# EAGLE design Termo3 (EAGLE 6.2)
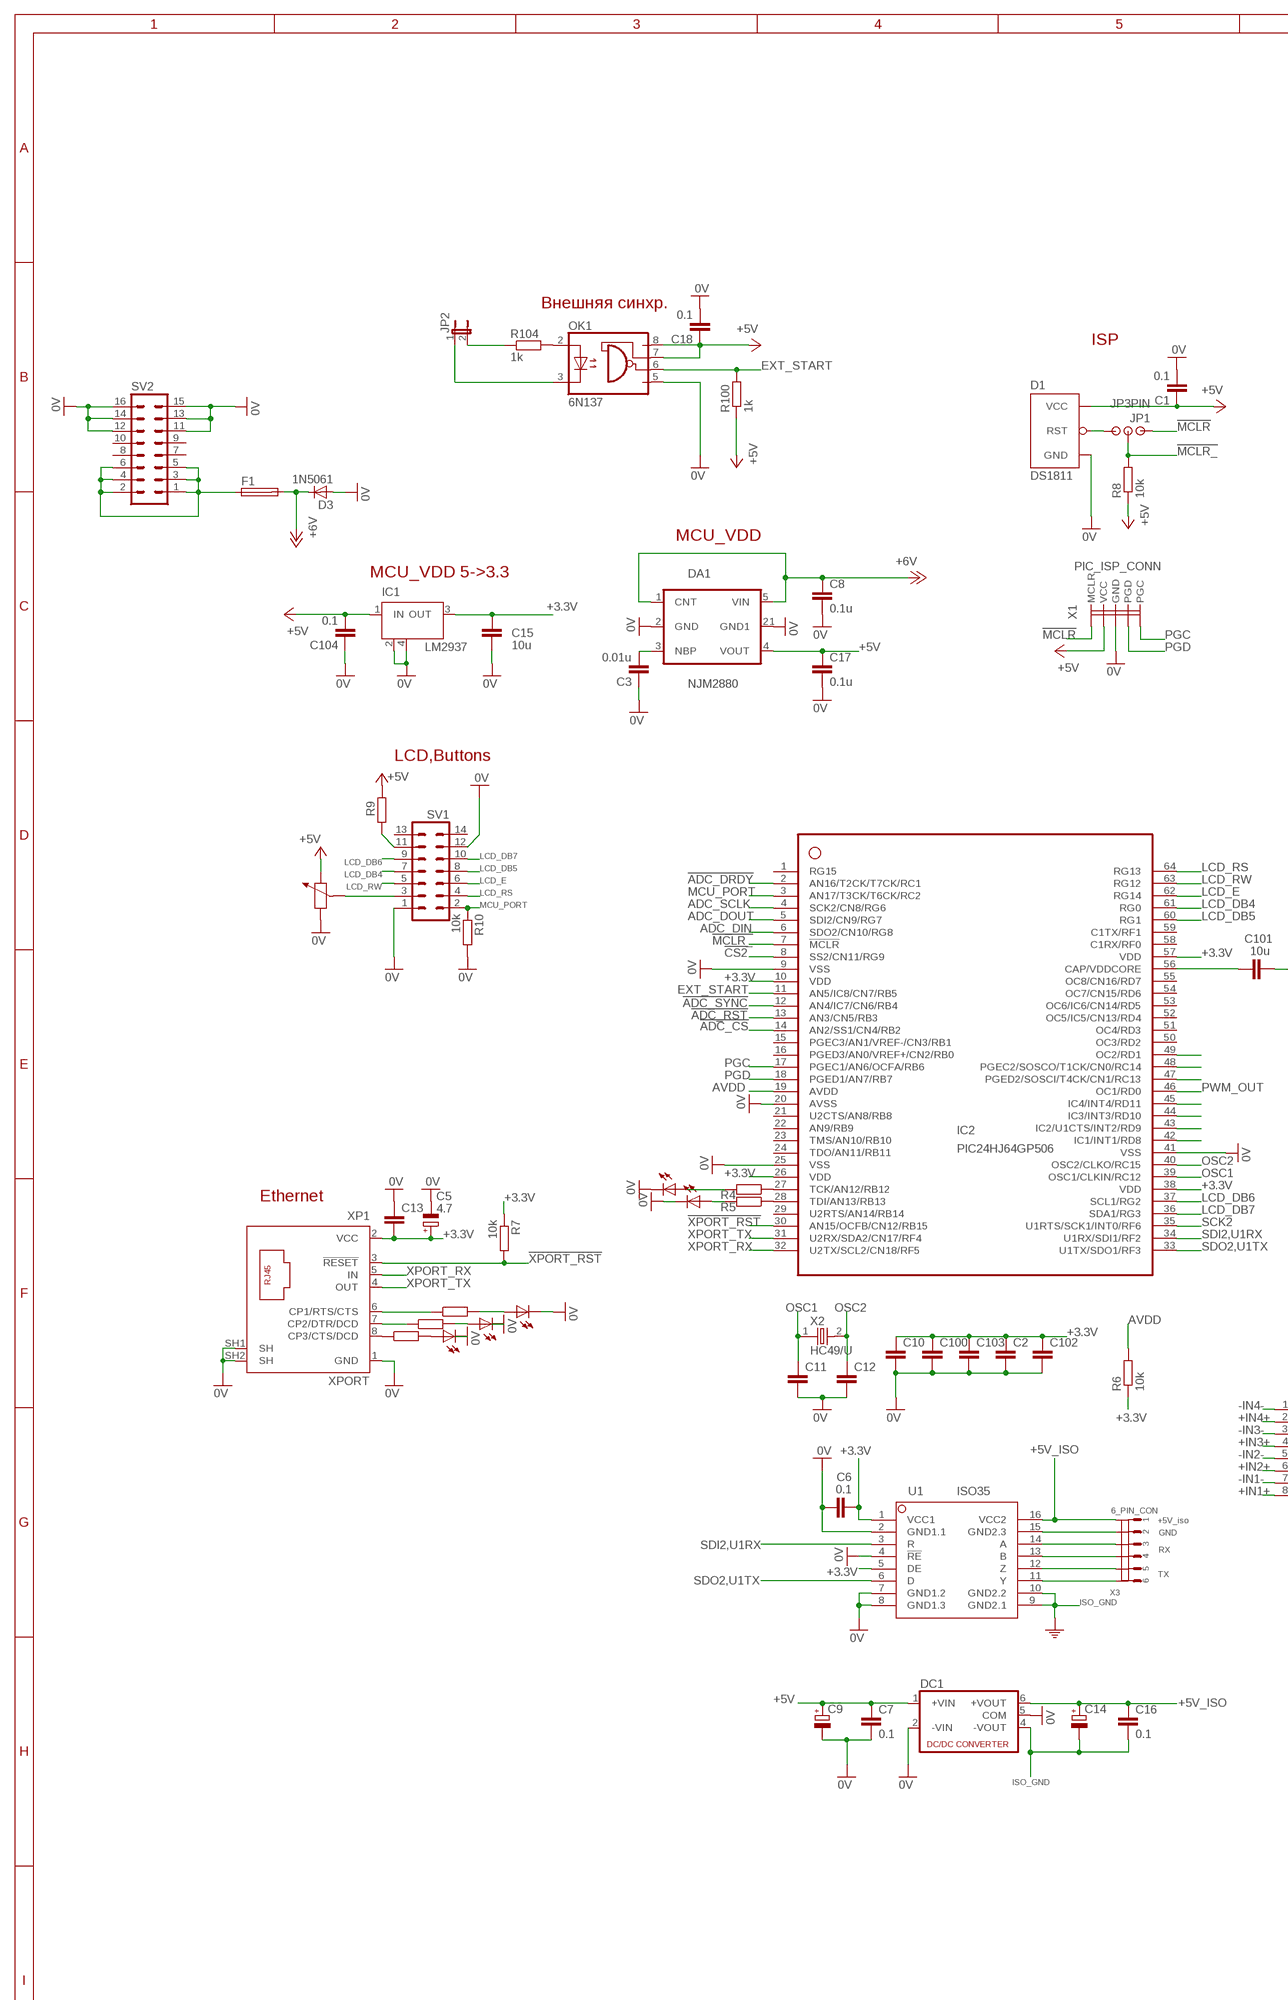
[diagram p0: schematic, sheet 1, part 1 of 2]
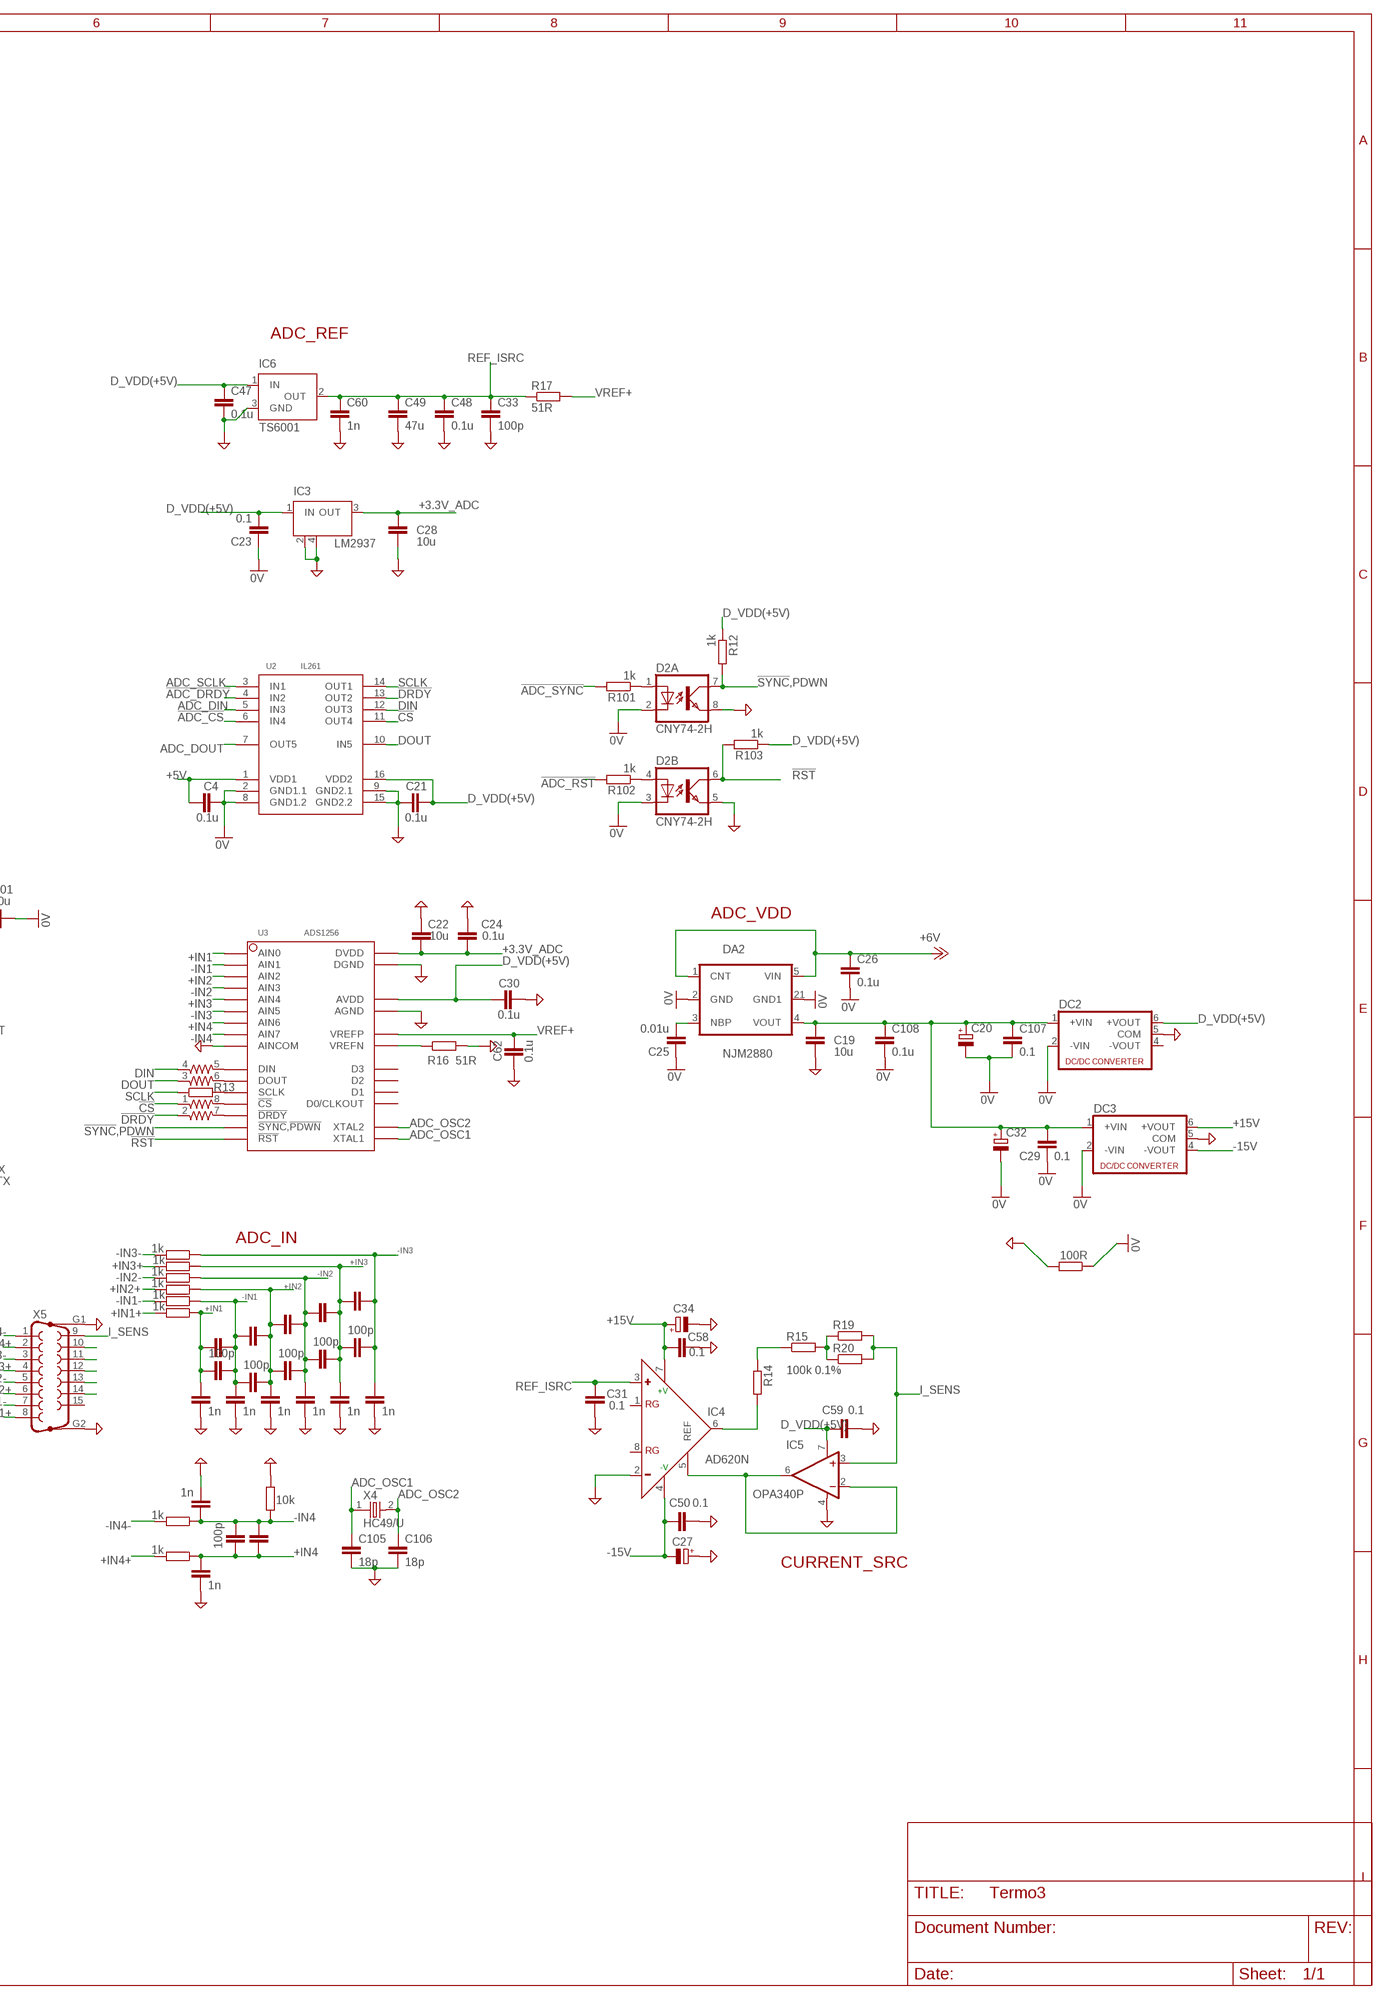
[diagram p1: schematic, sheet 1, part 2 of 2]

## Parts
C1  0.1  C0805  [C0805D]
C2  C0805  [C0805D]
C3  0.01u  C0805  [C0805D]
C4  0.1u  C0805  [C0805D]
C5  4.7  C100MFX25V  [C100MILX6X12]
C6  0.1  C0805  [C0805D]
C7  0.1  C0805  [C0805D]
C8  0.1u  C0805  [C0805D]
C9  C100MFX25V  [C100MILX6X12]
C10  C0805  [C0805D]
C11  C0805  [C0805D]
C12  C0805  [C0805D]
C13  C0805  [C0805D]
C14  C100MFX25V  [C100MILX6X12]
C15  10u  C0805  [C0805D]
C16  0.1  C0805  [C0805D]
C17  0.1u  C0805  [C0805D]
C18  0.1  C0805  [C0805D]
C19  10u  C0805  [C0805D]
C20  C100MFX25V  [C100MILX6X12]
C21  0.1u  C0805  [C0805D]
C22  10u  C0805  [C0805D]
C23  0.1  C0805  [C0805D]
C24  0.1u  C0805  [C0805D]
C25  0.01u  C0805  [C0805D]
C26  0.1u  C0805  [C0805D]
C27  C100MFX25V  [C100MILX6X12]
C28  10u  C0805  [C0805D]
C29  0.1  C0805  [C0805D]
C30  0.1u  C0805  [C0805D]
C31  0.1  C0805  [C0805D]
C32  C100MFX25V  [C100MILX6X12]
C33  100p  C0805  [C0805D]
C34  C100MFX25V  [C100MILX6X12]
C35  100p  C0805  [C0805D]
C36  100p  C0805  [C0805D]
C37  100p  C0805  [C0805D]
C38  100p  C0805  [C0805D]
C39  100p  C0805  [C0805D]
C40  100p  C0805  [C0805D]
C41  1n  C0805  [C0805D]
C42  1n  C0805  [C0805D]
C43  1n  C0805  [C0805D]
C44  1n  C0805  [C0805D]
C45  1n  C0805  [C0805D]
C46  1n  C0805  [C0805D]
C47  0.1u  C0805  [C0805D]
C48  0.1u  C0805  [C0805D]
C49  47u  C0805  [C0805D]
C50  0.1  C0805  [C0805D]
C51  1n  C0805  [C0805D]
C52  1n  C0805  [C0805D]
C53  1n  C0805  [C0805D]
C54  1n  C0805  [C0805D]
C55  1n  C0805  [C0805D]
C56  1n  C0805  [C0805D]
C57  1n  C0805  [C0805D]
C58  0.1  C0805  [C0805D]
C59  0.1  C0805  [C0805D]
C60  1n  C0805  [C0805D]
C61  1n  C0805  [C0805D]
C62  0.1u  C0805  [C0805D]
C100  C0805  [C0805D]
C101  10u  C0805  [C0805D]
C102  C0805  [C0805D]
C103  C0805  [C0805D]
C104  0.1  C0805  [C0805D]
C105  18p  C0805  [C0805D]
C106  18p  C0805  [C0805D]
C107  0.1  C0805  [C0805D]
C108  0.1u  C0805  [C0805D]
D1  DS1811  [TO92-60]
D2  CNY74-2H  [DIL08]
D3  1N5061  [DO41-10]
DA1  NJM2880  [SOT89-5]
DA2  NJM2880  [SOT89-5]
DC1  NMA  [NMA]
DC2  NMA  [NMA]
DC3  NMA  [NMA]
F1  TE5  [TE5]
HL1  LED3MM  [LED3MM]
HL2  LED3MM  [LED3MM]
HL3  LED3MM  [LED3MM]
HL4  LED3MM  [LED3MM]
HL5  LED3MM  [LED3MM]
IC1  LM2937  [SOT223]
IC2  PIC24HJ64GP506  [TQFP64-10X10]
IC3  LM2937  [SOT223]
IC4  AD620N  [DIL08]
IC5  OPA340P  [DIL08]
IC6  TS6001  [SOT23]
JP1  JP3PIN  [PLC-3PIN]
JP2  JP1E  [JP1]
OK1  6N137  [DIL08]
POT1  RTRIM3329H  [RTRIM3329H]
R1  1k  R0805  [R0805D]
R2  1k  R0805  [R0805D]
R3  1k  R0805  [R0805D]
R4  51R  R0805  [R0805D]
R5  51R  R0805  [R0805D]
R6  10k  R0805  [R0805D]
R7  10k  R0805  [R0805D]
R8  10k  R0805  [R0805D]
R9  MLT025"  [0207/10]
R10  10k  R0805  [R0805D]
R11  100R  R0805  [R0805D]
R12  1k  R0805  [R0805D]
R13  51R  R0805  [R0805D]
R14  MLT025"  [0207/10]
R15  100k 0.1%  MLT025"  [0207/10]
R16  51R  R0805  [R0805D]
R17  51R  R0805  [R0805D]
R18  10k  R0805  [R0805D]
R19  MLT025"  [0207/10]
R20  MLT025"  [0207/10]
R21  1k  R0805  [R0805D]
R22  1k  R0805  [R0805D]
R23  1k  R0805  [R0805D]
R24  1k  R0805  [R0805D]
R25  1k  R0805  [R0805D]
R26  1k  R0805  [R0805D]
R27  1k  R0805  [R0805D]
R28  1k  R0805  [R0805D]
R100  1k  R0805  [R0805D]
R101  1k  R0805  [R0805D]
R102  1k  R0805  [R0805D]
R103  1k  R0805  [R0805D]
R104  1k  R0805  [R0805D]
RN1  742-8_SNS  [742-8NS]
SV1  ML14  [ML14]
SV2  MA08-2W  [MA08-2W]
U1  ISO35  [ISO35_SOIC16]
U2  IL261  [SOIC-16]
U3  ADS1256  [PCM2705-TSSOP28]
X1  PIC_ISP_CONN  [PLC-5PIN]
X2  HC49/U  [HC49U-V]
X3  6_PIN_CON  [6_IN_PINS]
X4  HC49/U  [HC49U-V]
X5  F15HP  [F15HP]
XP1  XPORT  [XPORT]

## Nets
0V: C1.2 C2.2 C3.1 C4.2 C5.MINUS(-) C6.1 C7.2 C8.2 C9.MINUS(-) C10.2 C11.2 C12.2 C13.1 C15.1 C17.2 C18.2 C20.MINUS(-) C23.1 C25.1 C26.2 C29.1 C32.MINUS(-) C100.2 C101.2 C102.2 C103.2 C104.1 C107.2 C108.2 D1.3(GND) D2.2(A:C) D2.3(B:C) D3.A DA1.2(GND) DA1.21(GND1) DA2.2(GND) DA2.21(GND1) DC1.2(-VIN) DC1.5(COM) DC2.2(-VIN) DC3.2(-VIN) HL1.K(C) HL2.K(C) HL3.K(C) HL4.K(C) HL5.K(C) IC1.2(GND) IC1.4(GND) IC2.9(VSS) IC2.20(AVSS) IC2.25(VSS) IC2.41(VSS) OK1.5(GND) POT1.1 R10.P$2 R11.P$1 SV1.1 SV1.12 SV2.11 SV2.12 SV2.13 SV2.14 SV2.15 SV2.16 U1.2(GND1.1) U1.4(!RE) U1.7(GND1.2) U1.8(GND1.3) U2.2(GND1.1) U2.8(GND1.2) X1.P$3(GND) XP1.1(GND) XP1.SH1(SH) XP1.SH2(SH)
!ADC_CS: IC2.14(AN2/SS1/CN4/RB2) U2.6(IN4)
!ADC_DRDY: IC2.2(AN16/T2CK/T7CK/RC1) U2.4(IN2)
!ADC_RST: IC2.13(AN3/CN5/RB3) R102.P$2
!ADC_SYNC: IC2.12(AN4/IC7/CN6/RB4) R101.P$2
!CS: RN1.1 U2.11(OUT4)
!CS2: IC2.8(SS2/CN11/RG9)
!DRDY: RN1.2 U2.13(OUT2)
!MCLR: JP1.P$1 X1.P$1(MCLR)
!MCLR_: IC2.7(!MCLR) JP1.P$2 R8.P$2
!RST: D2.6(B:COL) R103.P$2 U3.15(!RST)
!SYNC,PDWN: D2.7(A:COL) R12.P$2 U3.14(!SYNC,!PDWN)
!XPORT_RST: IC2.30(AN15/OCFB/CN12/RB15) R7.P$2 XP1.3(!RESET)
+3.3V: C2.1 C5.PLUS(+) C6.2 C10.1 C13.2 C15.2 C100.1 C102.1 C103.1 IC1.3(OUT) IC2.10(VDD) IC2.26(VDD) IC2.38(VDD) IC2.57(VDD) R6.P$1 R7.P$1 U1.1(VCC1) U1.5(DE) XP1.2(VCC)
+3.3V_ADC: C22.2 C24.1 C28.2 IC3.3(OUT) U3.16(DVDD)
+5V: C1.1 C4.1 C7.1 C9.PLUS(+) C17.1 C18.1 C104.2 D1.2(VCC) DA1.4(VOUT) DC1.1(+VIN) IC1.1(IN) OK1.7(VE) OK1.8(VCC) POT1.2 R8.P$1 R9.2 R100.P$1 U2.1(VDD1) X1.P$2(VCC)
+5V_ISO: C14.PLUS(+) C16.1 DC1.6(+VOUT) U1.16(VCC2) X3.P$1
+6V: C8.1 C26.1 D3.C DA1.1(CNT) DA1.5(VIN) DA2.1(CNT) DA2.5(VIN) F1.2
+15V: C34.PLUS(+) C58.2 DC3.6(+VOUT) IC4.7(+V)
+IN1: C40.1 C46.1 C57.1 R28.P$1 U3.6(AIN0)
+IN1+: R28.P$2 X5.8
+IN2: C38.1 C39.2 C44.1 C45.2 C55.1 R26.P$1 U3.8(AIN2)
+IN2+: R26.P$2 X5.6
+IN3: C36.1 C37.2 C42.1 C43.2 C53.1 R24.P$1 U3.10(AIN4)
+IN3+: R24.P$2 X5.4
+IN4: C35.1 C41.1 C51.1 R22.P$1 U3.12(AIN6)
+IN4+: R22.P$2 X5.2
-15V: C27.MINUS(-) C50.2 DC3.4(-VOUT) IC4.4(-V)
-IN1: C39.1 C40.2 C45.1 C46.2 C56.1 R27.P$1 U3.7(AIN1)
-IN1-: R27.P$2 X5.7
-IN2: C37.1 C38.2 C43.1 C44.2 C54.1 R25.P$1 U3.9(AIN3)
-IN2-: R25.P$2 X5.5
-IN3: C36.2 C42.2 C52.1 R23.P$1 U3.11(AIN5)
-IN3-: R23.P$2 X5.3
-IN4: C35.2 C41.2 C61.1 R18.P$2 R21.P$1 U3.13(AIN7)
-IN4-: R21.P$2 X5.1
ADC_AVDD: C19.2 C20.PLUS(+) C29.2 C32.PLUS(+) C107.1 C108.1 DA2.4(VOUT) DC2.1(+VIN) DC3.1(+VIN)
ADC_DIN: IC2.6(SDO2/CN10/RG8) U2.5(IN3)
ADC_DOUT: IC2.5(SDI2/CN9/RG7) U2.7(OUT5)
ADC_OSC1: C105.1 U3.19(XTAL1) X4.1
ADC_OSC2: C106.1 U3.18(XTAL2) X4.2
ADC_SCLK: IC2.4(SCK2/CN8/RG6) U2.3(IN1)
AVDD: IC2.19(AVDD) R6.P$2
D_VDD(+5V): C21.2 C30.1 C47.1 C59.1 DC2.6(+VOUT) IC3.1(IN) IC5.7(V+) IC6.1(IN) R12.P$1 R103.P$1 U2.16(VDD2) U3.1(AVDD)
DGND: C19.1 C21.1 C22.1 C24.2 C27.PLUS(+) C28.1 C30.2 C31.2 C33.2 C34.MINUS(-) C47.2 C48.2 C49.2 C50.1 C51.2 C52.2 C53.2 C54.2 C55.2 C56.2 C57.2 C58.1 C59.2 C60.2 C61.2 C62.1 C105.2 C106.2 D2.5(B:EMIT) D2.8(A:EMIT) DC2.5(COM) DC3.5(COM) IC3.2(GND) IC3.4(GND) IC4.2(-) IC5.4(V-) IC6.3(GND) R11.P$2 R16.P$2 R18.P$1 U2.9(GND2.1) U2.15(GND2.2) U3.2(AGND) U3.5(AINCOM) U3.17(DGND) X5.G1 X5.G2
DIN: RN1.4 U2.12(OUT3)
DOUT: RN1.3 U2.10(IN5)
EXT_START: IC2.11(AN5/IC8/CN7/RB5) OK1.6(VO) R100.P$2
I_SENS: IC5.3(+IN) R19.2 R20.2 X5.9
ISO_GND: C14.MINUS(-) C16.2 DC1.4(-VOUT) U1.9(GND2.1) U1.10(GND2.2) U1.15(GND2.3) X3.P$2 ; supply symbol labelled PE
LCD_DB4: IC2.61(RG0) SV1.7
LCD_DB5: IC2.60(RG1) SV1.8
LCD_DB6: IC2.37(SCL1/RG2) SV1.9
LCD_DB7: IC2.36(SDA1/RG3) SV1.10
LCD_E: IC2.62(RG14) SV1.6
LCD_RS: IC2.64(RG13) SV1.4
LCD_RW: IC2.63(RG12) SV1.5
MCU_PORT: IC2.3(AN17/T3CK/T6CK/RC2) R10.P$1 SV1.2
N$1: C101.1 IC2.56(CAP/VDDCORE)
N$2: D1.1(RST) JP1.P$3
N$3: RN1.8 U3.20(!CS)
N$4: RN1.7 U3.21(!DRDY)
N$5: RN1.6 U3.22(DOUT)
N$6: RN1.5 U3.23(DIN)
N$7: R13.P$2 U3.24(SCLK)
N$9: IC2.45(IC4/INT4/RD11)
N$10: D2.1(A:A) R101.P$1
N$11: IC2.44(IC3/INT3/RD10)
N$12: IC4.5(REF) IC5.2(-IN) IC5.6(OUT)
N$13: IC2.43(IC2/U1CTS/INT2/RD9)
N$14: C25.2 DA2.3(NBP)
N$15: D2.4(B:A) R102.P$1
N$16: C3.2 DA1.3(NBP)
N$17: IC4.6(OUT) R14.2
N$18: POT1.3 SV1.3
N$19: R9.1 SV1.11
N$20: IC2.28(TDI/AN13/RB13) R5.P$1
N$21: HL2.A R5.P$2
N$22: IC2.42(IC1/INT1/RD8)
N$23: U1.3(R)
N$24: JP2.1 OK1.3(C)
N$25: IC2.47(PGED2/SOSCI/T4CK/CN1/RC13)
N$26: HL3.A R1.P$2
N$27: IC2.48(PGEC2/SOSCO/T1CK/CN0/RC14)
N$28: R1.P$1 XP1.6(CP1/RTS/CTS)
N$29: R2.P$1 XP1.7(CP2/DTR/DCD)
N$30: R3.P$1 XP1.8(CP3/CTS/DCD)
N$31: HL4.A R2.P$2
N$32: HL5.A R3.P$2
N$33: IC2.49(OC2/RD1)
N$37: X5.10
N$38: OK1.2(A) R104.P$2
N$39: JP2.2 R104.P$1
N$40: X5.11
N$41: X5.12
N$42: F1.1 SV2.1 SV2.2 SV2.3 SV2.4 SV2.5 SV2.6
N$43: IC2.27(TCK/AN12/RB12) R4.P$1
N$44: R14.1 R15.1
N$45: R16.P$1 U3.3(VREFN)
N$46: R15.2 R19.1 R20.1
N$47: U1.14(A) X3.P$3
N$48: HL1.A R4.P$2
N$49: X5.13
N$50: X5.14
N$51: U1.13(B) X3.P$4
N$52: U1.12(Z) X3.P$5
N$53: U1.11(Y) X3.P$6
OSC1: C11.1 IC2.39(OSC1/CLKIN/RC12) X2.1
OSC2: C12.1 IC2.40(OSC2/CLKO/RC15) X2.2
PGC: IC2.17(PGEC1/AN6/OCFA/RB6) X1.P$5(PGC)
PGD: IC2.18(PGED1/AN7/RB7) X1.P$4(PGD)
PWM_OUT: IC2.46(OC1/RD0)
REF_ISRC: C31.1 C33.1 C48.1 C49.1 C60.1 IC4.3(+) IC6.2(OUT) R17.P$1
SCK2: IC2.35(U1RTS/SCK1/INT0/RF6)
SCLK: R13.P$1 U2.14(OUT1)
SDI2,U1RX: IC2.34(U1RX/SDI1/RF2)
SDO2,U1TX: IC2.33(U1TX/SDO1/RF3) U1.6(D)
VREF+: C62.2 R17.P$2 U3.4(VREFP)
XPORT_RX: IC2.32(U2TX/SCL2/CN18/RF5) XP1.5(IN)
XPORT_TX: IC2.31(U2RX/SDA2/CN17/RF4) XP1.4(OUT)
Unconnected: C23.2 DC2.4(-VOUT) IC2.1(RG15) IC2.15(PGEC3/AN1/VREF-/CN3/RB1) IC2.16(PGED3/AN0/VREF+/CN2/RB0) IC2.21(U2CTS/AN8/RB8) IC2.22(AN9/RB9) IC2.23(TMS/AN10/RB10) IC2.24(TDO/AN11/RB11) IC2.29(U2RTS/AN14/RB14) IC2.50(OC3/RD2) IC2.51(OC4/RD3) IC2.52(OC5/IC5/CN13/RD4) IC2.53(OC6/IC6/CN14/RD5) IC2.54(OC7/CN15/RD6) IC2.55(OC8/CN16/RD7) IC2.58(C1RX/RF0) IC2.59(C1TX/RF1) IC4.1(RG) IC4.8(RG) SV1.13 SV1.14 SV2.7 SV2.8 SV2.9 SV2.10 U3.25(D0/CLKOUT) U3.26(D1) U3.27(D2) U3.28(D3) X5.15

## Notes on the sheet
- Внешняя синхр.
- ISP
- ADC_REF
- MCU_VDD
- MCU_VDD 5->3.3
- LCD,Buttons
- ADC_VDD
- Ethernet
- ADC_IN
- +5V_iso
- GND
- RX
- TX
- CURRENT_SRC

## Library data of the parts
C1-C4 C6-C8 C10-C13 C15-C19 C21-C26 C28-C31 C33 C35-C62 C100-C108 = den:C0805
C5 C9 C14 C20 C27 C32 C34 = den:C100MFX25V
D1 = den:DS1811
D2 = den:CNY74-2H
D3 = den:1N5061
DA1 DA2 = den:NJM2880
DC1-DC3 = dc-dc-converter:NMA: DC-DC CONVERTER; MF: C & D TECHNOLOGIES, INC; MPN: NMA0515SC; OC_FARNELL: 1021434; OC_NEWARK: 61K3064
F1 = fuse:TE5: FUSE Wickmann; OC_FARNELL: unknown; OC_NEWARK: unknown
HL1-HL5 = den:LED3MM
IC1 IC3 = Dmitry:LM2937: 3-Terminal Positive Regulators
IC2 = Dmitry:PIC24HJ64GP506: PIC24HJ64GP506 edit this description Auto generated by make-symbol-device-package-bsdl.ulp Rev. 25 Source: PIC24HJ64GP506.bsd; MPN: PIC24HJ64GP506A-I/PT; OC_FARNELL: 1146551; OC_NEWARK: 45P4882
IC4 = analog-devices:AD620: Low Cost, Low Power, Instrumentation Amplifier Source: http://www.analog.com/UploadedFiles/Data_Sheets/37793330023930AD620_e.pdf; MF: ALTERA CORPORATION; MPN: AD620AN; OC_FARNELL: 1523782; OC_NEWARK: 05F7108
IC5 = burr-brown:OPA340: Rail-to-Rail Operational Amplifiers Single-Supply, MicroAmplifier(TM) Series; MPN: OPA340PA; OC_FARNELL: 1097413; OC_NEWARK: 97K6826
IC6 = Dmitry:TS6001: 2.5V Voltage Reference 0.8ppm/°C, SOT23, 3-Terminal; MF: TS; OC_FARNELL: unknown; OC_NEWARK: 02J4586
JP1 = den:JP3PIN
JP2 = jumper:JP1E: JUMPER
OK1 = optocoupler:6N137: MOTOROLA OPTO COUPLER; MPN: 6N137; OC_FARNELL: 1328376; OC_NEWARK: 52M1895
POT1 = Dmitry:RTRIM3329H
R1-R8 R10-R13 R16-R18 R21-R28 R100-R104 = den:R0805
R9 R14 R15 R19 R20 = den:MLT025
RN1 = resistor-array:742-8_S: CTS 742 Series 8 Terminations, 4 Resistors
SV1 = con-harting-ml:ML14: HARTING; OC_FARNELL: unknown; OC_NEWARK: unknown
SV2 = con-lstb:MA08-2W: PIN HEADER; OC_FARNELL: unknown; OC_NEWARK: unknown
U1 = Dmitry:ISO35: RS485
U2 = Dmitry:IL261
U3 = Dmitry:ADS1256: TI ADS1256 - 24 bit delta sigma ADC TSSOP28 PAC
X1 = den:PIC_ISP_CONN
X2 X4 = den:HC49/U
X3 = Dmitry:6_PIN_CON
X5 = con-subd:F15HP: SUB-D; OC_FARNELL: unknown; OC_NEWARK: unknown
XP1 = lantronix:XPORT: Serial to 10/100 Ethernet transceiver Source: http://www.lantronix.com/pdf/XPort_DS.pdf; OC_FARNELL: unknown; OC_NEWARK: unknown

## Board
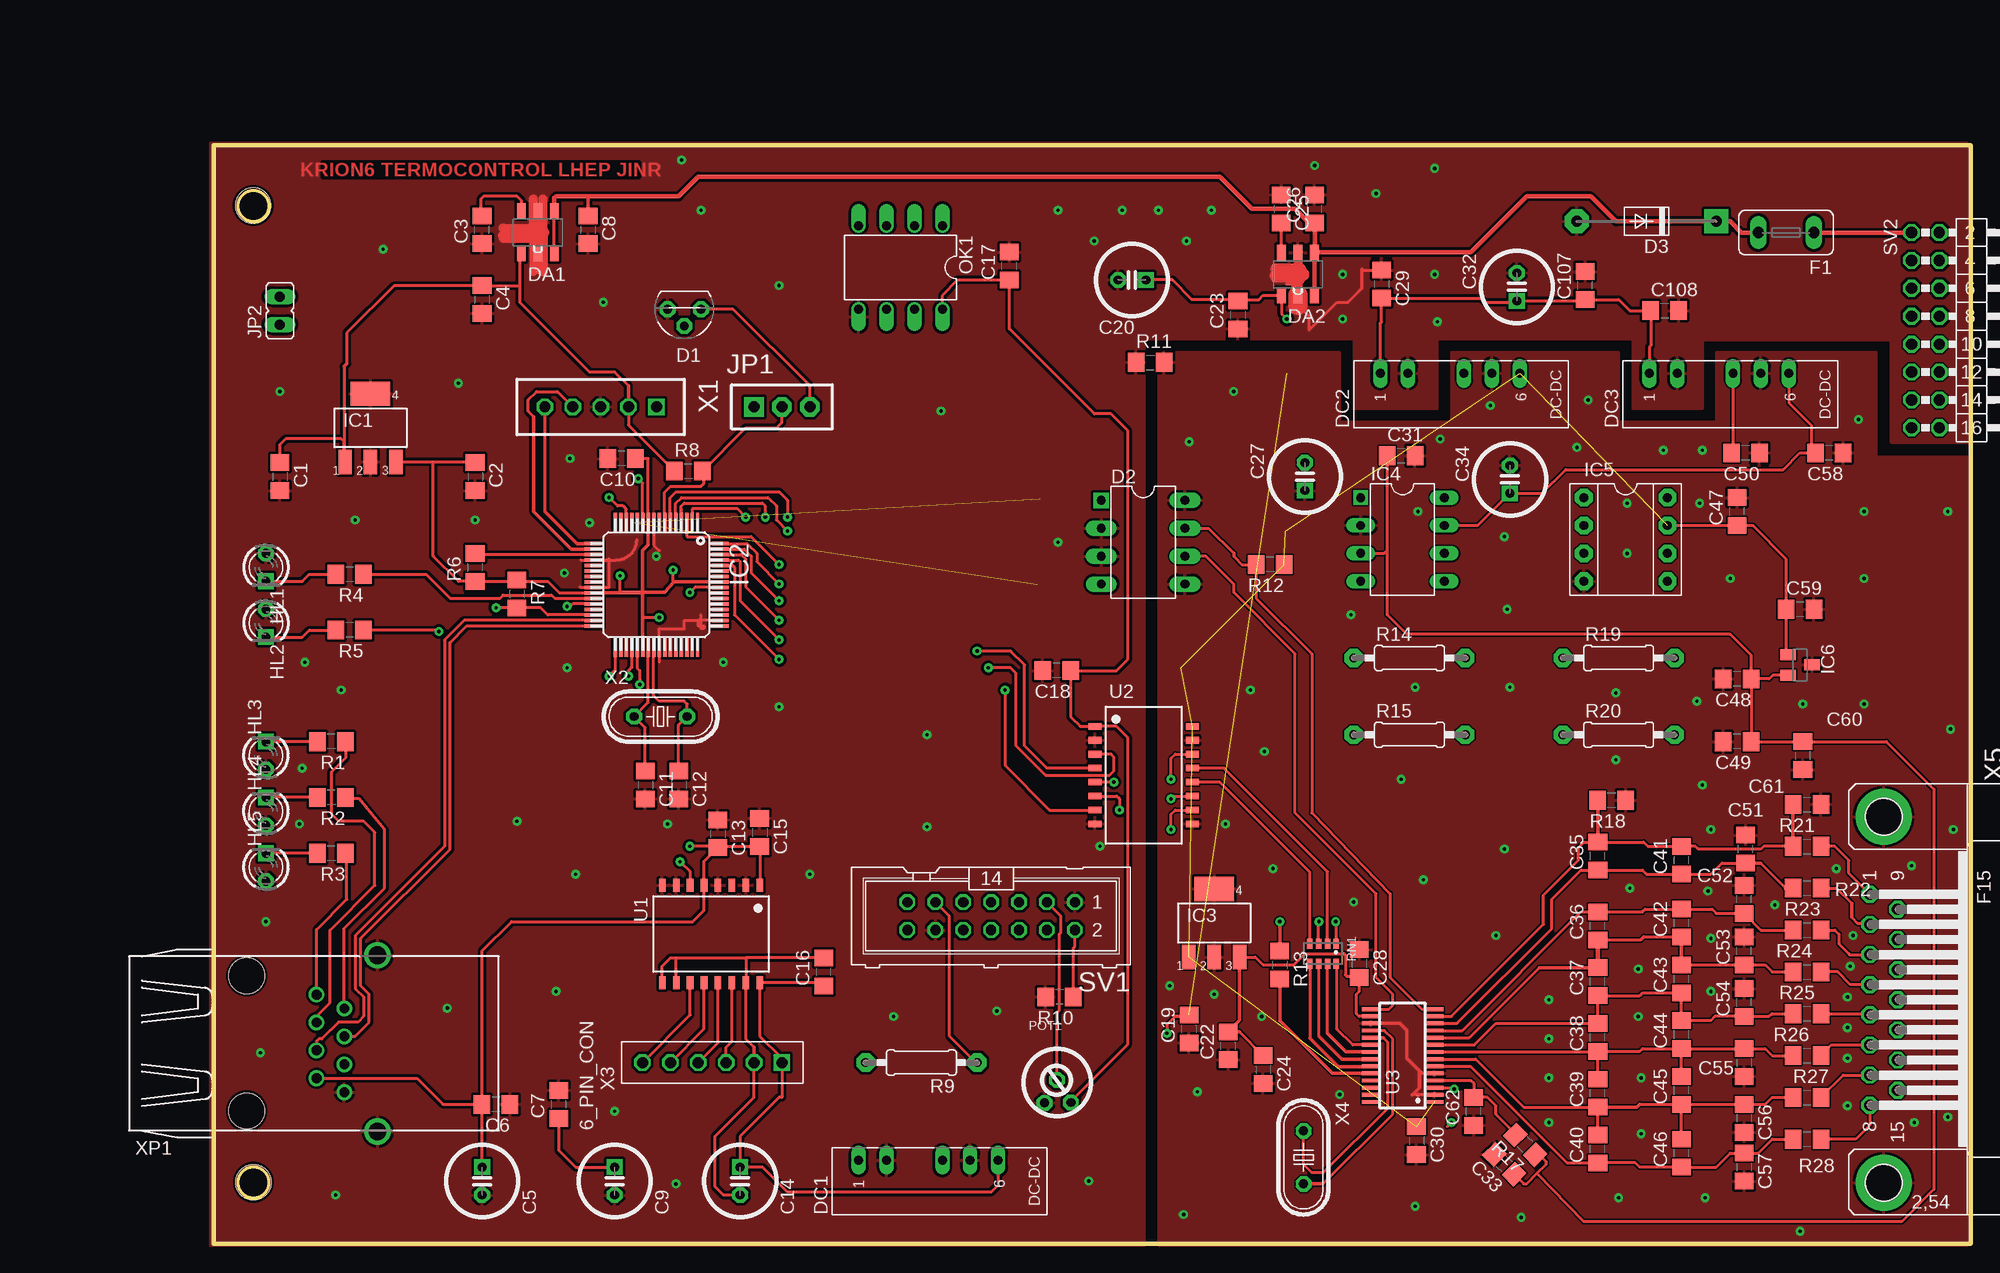
[diagram p2: board, top side]
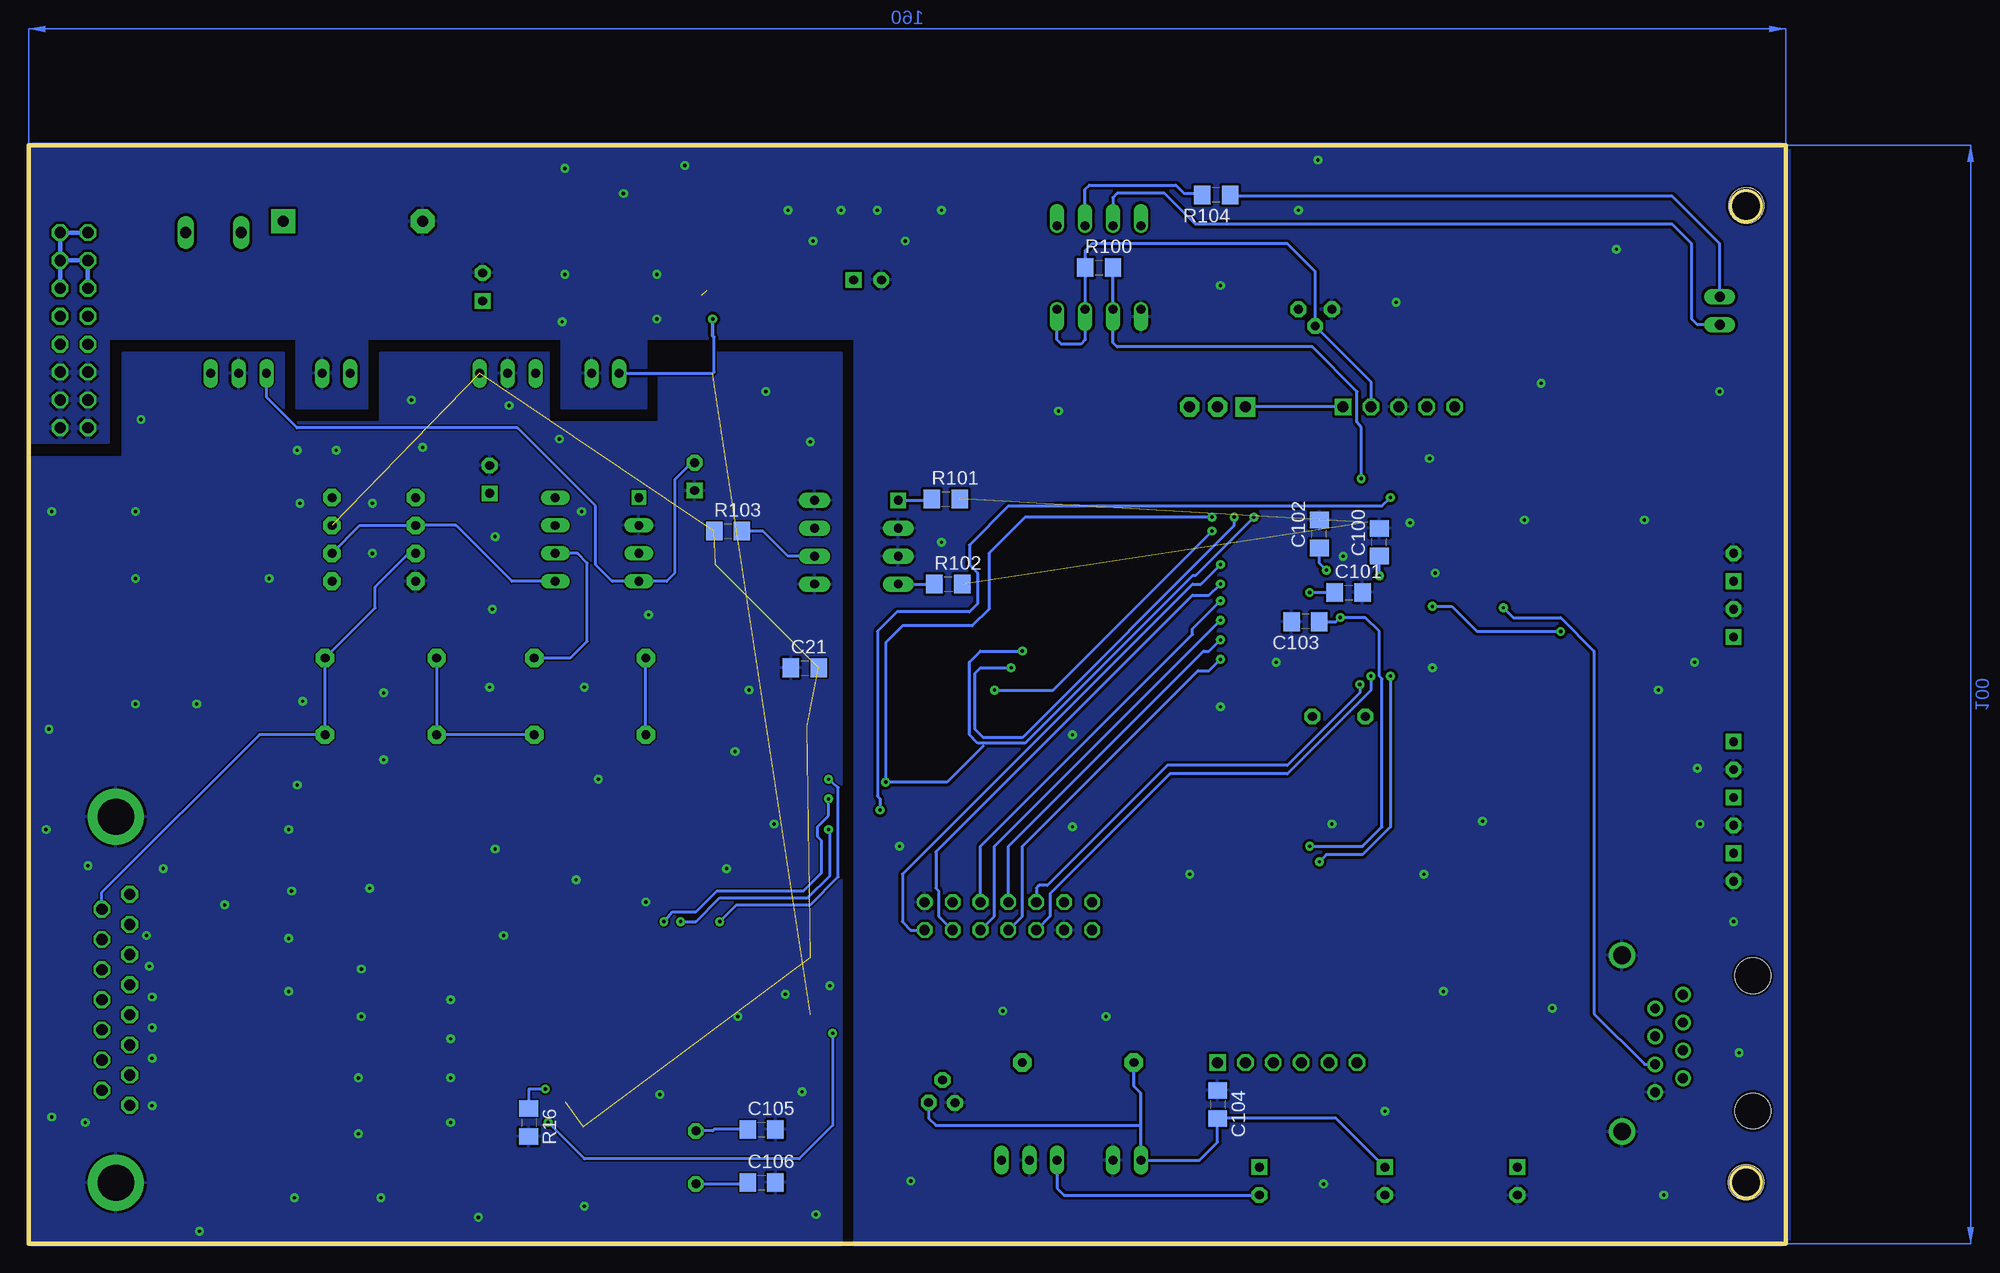
[diagram p3: board, bottom side, seen from below]

Size 160 x 100 mm. Coordinates in mm from the lower left corner, seen from the top.
Outline: 0,100 160,100 160,0 0,0 0,100
Outline: circle at 3.6,5.6 radius 1.4
Outline: circle at 3.6,94.5 radius 1.4
Copper layers (1*16): Top 0.035mm / dielectric 1.5mm / Bottom 0.035mm
Design rules: minimum track width 6mil, minimum drill 10mil, track to track 6mil, track to pad 6mil, pad to pad 6mil, via to via 6mil, smd to smd 0mil, copper to edge 0mil, drill to drill 8mil, minimum pad ring 10mil, minimum via ring 8mil, stop-mask expansion 4mil, vias tented up to drill 0mil, thermal gap 10mil
Holes 3.2 mm at 3.59,94.53 3.62,5.61

### Footprints (pad centres in the part's own frame; a part is rotated, then mirrored left to right if it is on the bottom)
C0805D = smd 1.5 x 1.7: 1 -1.27,0; 2 1.27,0
C100MILX6X12 = drill 0.8 pad 1.422 octagon: MINUS 1.27,0 | drill 0.8 pad 1.422 square: PLUS -1.27,0
TO92-60 = drill 0.8 pad 1.422 octagon: 1 -1.524,0; 2 0,1.524; 3 1.524,0
DIL08 = drill 0.8 pad 1.422 square: 1 -3.81,-3.81 | drill 0.8 pad 1.422 long: 2 -1.27,-3.81; 3 1.27,-3.81; 4 3.81,-3.81; 5 3.81,3.81; 6 1.27,3.81; 7 -1.27,3.81; 8 -3.81,3.81
DO41-10 = drill 1 pad 2.184 octagon: A 12.7,0 | drill 1 pad 2.184 square: C 0,0
SOT89-5 = smd 0.8 x 1.4: 1 -1.499,-1.981; 2 0,-1.981; 3 1.499,-1.981; 4 1.499,1.919; 5 -1.499,1.919; 21 0,1.919
NMA = drill 0.813 long: 1 0,6.35; 2 0,3.81; 4 0,-1.27; 5 0,-3.81; 6 0,-6.35
TE5 = drill 1.016 long: 1 -2.54,0; 2 2.54,0
LED3MM = drill 0.8 pad 1.422 square: A 1.27,0 | drill 0.8 pad 1.422 octagon: K -1.27,0
SOT223 = smd 1.219 x 2.235: 1 -2.311,-3.099; 2 0,-3.099; 3 2.311,-3.099 | smd 3.6 x 2.2: 4 0,3.099
TQFP64-10X10 = smd 1.7 x 0.3: 1 -5.7,3.75; 2 -5.7,3.25; 3 -5.7,2.75; 4 -5.7,2.25; 5 -5.7,1.75; 6 -5.7,1.25; 7 -5.7,0.75; 8 -5.7,0.25; 9 -5.7,-0.25; 10 -5.7,-0.75; 11 -5.7,-1.25; 12 -5.7,-1.75; 13 -5.7,-2.25; 14 -5.7,-2.75; 15 -5.7,-3.25; 16 -5.7,-3.75; 33 5.7,-3.75; 34 5.7,-3.25; 35 5.7,-2.75; 36 5.7,-2.25; 37 5.7,-1.75; 38 5.7,-1.25; 39 5.7,-0.75; 40 5.7,-0.25; 41 5.7,0.25; 42 5.7,0.75; 43 5.7,1.25; 44 5.7,1.75; 45 5.7,2.25; 46 5.7,2.75; 47 5.7,3.25; 48 5.7,3.75 | smd 0.3 x 1.7: 17 -3.75,-5.7; 18 -3.25,-5.7; 19 -2.75,-5.7; 20 -2.25,-5.7; 21 -1.75,-5.7; 22 -1.25,-5.7; 23 -0.75,-5.7; 24 -0.25,-5.7; 25 0.25,-5.7; 26 0.75,-5.7; 27 1.25,-5.7; 28 1.75,-5.7; 29 2.25,-5.7; 30 2.75,-5.7; 31 3.25,-5.7; 32 3.75,-5.7; 49 3.75,5.7; 50 3.25,5.7; 51 2.75,5.7; 52 2.25,5.7; 53 1.75,5.7; 54 1.25,5.7; 55 0.75,5.7; 56 0.25,5.7; 57 -0.25,5.7; 58 -0.75,5.7; 59 -1.25,5.7; 60 -1.75,5.7; 61 -2.25,5.7; 62 -2.75,5.7; 63 -3.25,5.7; 64 -3.75,5.7
DIL08' = drill 0.813 square: 1 -3.81,-3.81 | drill 0.813 long: 2 -1.27,-3.81; 3 1.27,-3.81; 4 3.81,-3.81; 5 3.81,3.81; 6 1.27,3.81; 7 -1.27,3.81; 8 -3.81,3.81
DIL08'' = drill 0.813 pad 1.6 octagon: 1 -3.81,-3.81; 2 -1.27,-3.81; 3 1.27,-3.81; 4 3.81,-3.81; 5 3.81,3.81; 6 1.27,3.81; 7 -1.27,3.81; 8 -3.81,3.81
SOT23 = smd 1 x 1.4: 1 -0.95,-1.1; 2 0.95,-1.1; 3 0,1.1
PLC-3PIN = drill 1 pad 1.778 square: P$1 0,0 | drill 1 pad 1.778 octagon: P$2 2.54,0; P$3 5.08,0
JP1 = drill 0.914 long: 1 0,-1.27; 2 0,1.27
DIL08''' = drill 0.813 offset: 1 -3.81,-3.81; 2 -1.27,-3.81; 3 1.27,-3.81; 4 3.81,-3.81; 5 3.81,3.81; 6 1.27,3.81; 7 -1.27,3.81; 8 -3.81,3.81
RTRIM3329H = drill 0.8 pad 1.422 octagon: 1 -0.599,-2.024; 2 1.805,-1.985; 3 0.537,0.066
R0805D = smd 1.5 x 1.7: P$1 -1.27,0; P$2 1.27,0
0207/10 = drill 0.8 pad 1.676 octagon: 1 -5.08,0; 2 5.08,0
742-8NS = smd 0.5 x 0.9: 1 -1.2,-0.9; 2 -0.4,-0.9; 3 0.4,-0.9; 4 1.2,-0.9; 5 1.2,0.9; 6 0.4,0.9; 7 -0.4,0.9; 8 -1.2,0.9
ML14 = drill 0.914 octagon: 1 -7.62,-1.27; 2 -7.62,1.27; 3 -5.08,-1.27; 4 -5.08,1.27; 5 -2.54,-1.27; 6 -2.54,1.27; 7 0,-1.27; 8 0,1.27; 9 2.54,-1.27; 10 2.54,1.27; 11 5.08,-1.27; 12 5.08,1.27; 13 7.62,-1.27; 14 7.62,1.27
MA08-2W = drill 1.016 octagon: 1 -8.89,-1.27; 2 -8.89,1.27; 3 -6.35,-1.27; 4 -6.35,1.27; 5 -3.81,-1.27; 6 -3.81,1.27; 7 -1.27,-1.27; 8 -1.27,1.27; 9 1.27,-1.27; 10 1.27,1.27; 11 3.81,-1.27; 12 3.81,1.27; 13 6.35,-1.27; 14 6.35,1.27; 15 8.89,-1.27; 16 8.89,1.27
ISO35_SOIC16 = smd 0.6 x 1.2: 1 -4.445,-4.445; 2 -3.175,-4.445; 3 -1.905,-4.445; 4 -0.635,-4.445; 5 0.635,-4.445; 6 1.905,-4.445; 7 3.175,-4.445; 8 4.445,-4.445; 9 4.445,4.445; 10 3.175,4.445; 11 1.905,4.445; 12 0.635,4.445; 13 -0.635,4.445; 14 -1.905,4.445; 15 -3.175,4.445; 16 -4.445,4.445
SOIC-16 = smd 0.6 x 1.2: 1 -4.445,-4.445; 2 -3.175,-4.445; 3 -1.905,-4.445; 4 -0.635,-4.445; 5 0.635,-4.445; 6 1.905,-4.445; 7 3.175,-4.445; 8 4.445,-4.445; 9 4.445,4.445; 10 3.175,4.445; 11 1.905,4.445; 12 0.635,4.445; 13 -0.635,4.445; 14 -1.905,4.445; 15 -3.175,4.445; 16 -4.445,4.445
PCM2705-TSSOP28 = smd 0.35 x 1.6: 1 -4.225,-2.9; 2 -3.575,-2.9; 3 -2.925,-2.9; 4 -2.275,-2.9; 5 -1.625,-2.9; 6 -0.975,-2.9; 7 -0.325,-2.9; 8 0.325,-2.9; 9 0.975,-2.9; 10 1.625,-2.9; 11 2.275,-2.9; 12 2.925,-2.9; 13 3.575,-2.9; 14 4.225,-2.9; 15 4.225,2.9; 16 3.575,2.9; 17 2.925,2.9; 18 2.275,2.9; 19 1.625,2.9; 20 0.975,2.9; 21 0.325,2.9; 22 -0.325,2.9; 23 -0.975,2.9; 24 -1.625,2.9; 25 -2.275,2.9; 26 -2.925,2.9; 27 -3.575,2.9; 28 -4.225,2.9
PLC-5PIN = drill 1 square: P$1 0,5.08 | drill 1 octagon: P$2 0,2.54; P$3 0,0; P$4 0,-2.54; P$5 0,-5.08
HC49U-V = drill 0.8 pad 1.422 octagon: 1 -2.413,0; 2 2.413,0
6_IN_PINS = drill 1 pad 1.422 square: P$1 0,0 | drill 1 pad 1.422 octagon: P$2 2.54,0; P$3 5.08,0; P$4 7.62,0; P$5 10.16,0; P$6 12.7,0
F15HP = drill 1.016 octagon: 1 -9.601,-1.27; 2 -6.858,-1.27; 3 -4.115,-1.27; 4 -1.372,-1.27; 5 1.372,-1.27; 6 4.115,-1.27; 7 6.858,-1.27; 8 9.601,-1.27; 9 -8.23,1.27; 10 -5.486,1.27; 11 -2.743,1.27; 12 0,1.27; 13 2.743,1.27; 14 5.486,1.27; 15 8.23,1.27 | drill 3.302 pad 5.08: G1 -16.662,0; G2 16.662,0
XPORT = drill 0.9 pad 1.422: 1 1.27,-4.445; 2 -1.27,-3.175; 3 1.27,-1.905; 4 -1.27,-0.635; 5 1.27,0.635; 6 -1.27,1.905; 7 1.27,3.175; 8 -1.27,4.445 | drill 1.6 pad 2.2: SH1 4.28,8.025; SH2 4.28,-8.025 | hole 3.25: -7.62,-6.15; -7.62,6.15

### Placement (x,y rotation side)
C1  6.03,69.84 270 top
C2  23.81,69.84 270 top
C3  24.45,92.32 90 top
C4  24.45,85.97 270 top
C5  24.45,5.71 270 top
C6  25.71,12.7 180 top
C7  31.43,12.7 90 top
C8  34.1,92.32 270 top
C9  36.51,5.71 270 top
C10  37.15,71.5 180 top
C11  39.3,41.78 270 top
C12  42.35,41.78 270 top
C13  45.91,37.33 270 top
C14  47.94,5.71 270 top
C15  49.72,37.46 270 top
C16  55.56,24.76 90 top
C17  72.45,89.02 90 top
C18  76.77,52.19 180 top
C19  88.83,19.55 90 top
C20  83.63,87.75 180 top
C21  89.34,52.45 0 bottom
C22  92.39,18.03 90 top
C23  93.28,84.58 90 top
C24  95.57,15.87 270 top
C25  97.22,94.23 270 top
C26  100.26,94.23 90 top
C27  99.38,69.84 90 top
C28  104.33,25.52 270 top
C29  106.36,87.37 270 top
C30  109.54,9.39 270 top
C31  108.14,71.75 0 top
C32  118.68,87.12 90 top
C33  117.54,7.23 135 top
C34  118.04,69.59 90 top
C35  126.05,35.3 90 top
C36  126.05,28.95 90 top
C37  126.05,23.87 90 top
C38  126.05,18.79 90 top
C39  126.05,13.71 90 top
C40  126.05,8.63 90 top
C41  133.67,34.92 90 top
C42  133.67,29.2 90 top
C43  133.67,24.12 90 top
C44  133.67,19.04 90 top
C45  133.67,13.96 90 top
C46  133.67,8.25 90 top
C47  138.75,66.67 90 top
C48  138.75,51.43 180 top
C49  138.75,45.72 180 top
C50  139.51,72 180 top
C51  139.51,35.94 90 top
C52  139.38,31.36 90 top
C53  139.38,26.66 90 top
C54  139.38,21.97 90 top
C55  139.38,16.5 270 top
C56  139.38,11.43 270 top
C57  139.38,6.98 270 top
C58  147.13,72 180 top
C59  144.46,57.78 0 top
C60  144.71,44.45 270 top
C61  145.09,40 0 top
C62  114.74,12.06 90 top
C100  37.02,63.88 90 bottom
C101  39.81,59.3 0 bottom
C102  42.48,64.64 90 bottom
C103  43.75,56.64 180 bottom
C104  51.75,12.7 270 bottom
C105  93.28,10.41 0 bottom
C106  93.28,5.58 0 bottom
C107  124.9,87.24 90 top
C108  132.14,84.96 0 top
D1  42.86,85.08 180 top
D2  84.64,63.88 270 top
D3  136.84,93.09 180 top
DA1  29.52,92.07 180 top
DA2  98.74,88.26 180 top
DC1  65.09,7.62 90 top
DC2  112.58,79.24 90 top
DC3  137.09,79.24 90 top
F1  143.19,92.07 180 top
HL1  4.76,61.59 270 top
HL2  4.76,56.51 270 top
HL3  4.76,44.45 90 top
HL4  4.76,39.37 90 top
HL5  4.76,34.29 90 top
IC1  14.29,74.29 0 top
IC2  40.33,60.01 270 top
IC3  91.12,29.2 0 top
IC4  AD620N  [DIL08']  108.27,64.13 270 top
IC5  OPA340P  [DIL08'']  128.59,64.13 270 top
IC6  144.46,52.7 270 top
JP1  49.21,76.19 0 top
JP2  6.03,84.96 0 top
OK1  6N137  [DIL08''']  62.55,88.89 180 top
POT1  76.26,14.85 0 top
R1  10.73,45.72 180 top
R2  10.73,40.64 180 top
R3  10.73,35.55 180 top
R4  12.38,60.96 180 top
R5  12.38,55.88 180 top
R6  23.81,61.59 90 top
R7  27.62,59.18 270 top
R8  43.24,70.35 0 top
R9  64.45,16.5 180 top
R10  77.02,22.47 180 top
R11  85.28,80.26 0 top
R12  96.2,61.84 180 top
R13  97.09,25.39 270 top
R14  108.9,53.34 0 top
R15  108.9,46.35 0 top
R16  114.49,11.04 270 bottom
R17  119.44,9.01 135 top
R18  127.32,40.38 180 top
R19  127.95,53.34 0 top
R20  127.95,46.35 0 top
R21  145.09,36.19 0 top
R22  145.09,32.38 0 top
R23  145.09,28.57 0 top
R24  145.09,24.76 0 top
R25  145.09,20.95 0 top
R26  145.09,17.14 0 top
R27  145.09,13.33 0 top
R28  145.09,9.52 0 top
R100  62.55,88.89 0 bottom
R101  76.52,67.81 0 bottom
R102  76.26,60.07 0 bottom
R103  96.33,64.89 0 bottom
R104  51.88,95.5 180 bottom
RN1  101.03,26.41 180 top
SV1  70.8,29.84 180 top
SV2  155.89,83.18 270 top
U1  45.29,28.2 180 top
U2  84.7,42.67 270 top
U3  108.27,17.14 90 top
X1  35.24,76.19 270 top
X2  40.7,48 0 top
X3  51.75,16.5 180 top
X4  99.25,7.87 270 top
X5  152.08,22.22 270 top
XP1  10.63,18.24 0 top

### Tracks (layer width: path | path; a pad name or v marks a point on that pad's centre or on a via)
0V  (via drill 0.3 pad 0.8)  (1 unrouted)
  Top 0.254: IC2.41 | IC2.41 40.57,56 42.86,56 42.86,56.76 44.13,56.76 | 46.67,56.76 44.13,56.76 | 44.13,56.76 44.13,56.26 44.64,56.26 44.64,56 44.38,56 44.38,57.27 | IC2.20 35.91,62.26 36,62.35 36,59.76 IC2.25 34.67,59.76 34.71,59.79 33.36,59.79 | IC2.20 36.67,62.26 arc90 38.54,64.13 | IC2.9 40.08,63.61 40.57,63.11 | IC2.41 40.57,52.95 | 33.43,62.25 IC2.20 | 34.78,62.25 IC2.20 | IC2.20 | 98.74,85.47 99.76,84.45 99.76,83.18 102.3,85.72 103.31,85.72 104.58,86.99 104.58,88.77 104.71,88.64 C29.1 | 97.67,87.4 98.23,87.4 98.23,86.81
  Top 0.406: DA2.21 DA2.2
  Top 0.813: 29.65,92.32 29.55,92.32 29.55,88.72 | 29.09,95.14 29.09,91.54 | 29.96,95.12 29.96,92.48 | 29.96,92.48 29.96,91.51 | 29.12,92.12 29.12,88.51 | 30.01,92.09 30.01,91.54 | 30.01,91.54 30.01,88.49 | 26.35,92.48 29.96,92.48 | 26.3,91.82 29.91,91.82 | 26.4,91.54 30.01,91.54
  Top 1.016: 96.71,88.77 98.99,88.77 98.99,88.01 96.71,88.01 96.71,88.26
  Top 1.778: DA2.21 98.74,85.47
  other vias: 40.32,62.61 86.04,94.1 88.58,91.31 90.87,94.1 80.2,91.31 76.9,94.1 82.74,94.1 100.26,98.17 105.85,95.63 111.19,97.91 102.8,84.2 102.8,88.26 111.19,88.26 111.44,83.94 66.23,75.81 51.5,87.24 35.49,85.72 15.43,90.55 42.61,98.67 44.38,94.1 76.9,63.88 64.96,46.35 51.5,48.89 46.42,52.95 32.19,52.45 31.94,61.08 34.22,65.65 32.45,71.5 23.81,65.91 12.89,65.91 6.03,77.59 22.29,78.35 27.62,38.48 31.18,22.98 41.34,38.22 54.29,33.65 61.91,20.7 71.31,21.2 79.69,5.71 42.1,5.46 36.51,12.06 11.11,4.44 4.25,17.39 21.27,21.46 4.76,29.33 7.81,38.22 8.06,43.3 11.62,50.41 8.32,52.95 32.95,33.65 64.96,37.97 80.71,36.19
  pour Top (isolate 0.254): -0.32,100.2 -0.32,-0.13 84.77,-0.13 84.77,82.42 103.82,82.42 103.82,76.07 111.44,76.07 111.44,82.42 129.22,82.42 129.22,76.07 135.6,76.07 135.6,82.29 159.7,82.29 159.7,100.2
  pour Bottom (isolate 0.254): -0.32,100.2 -0.32,-0.13 84.77,-0.13 84.77,69.72 84.77,82.42 103.82,82.42 103.82,76.07 111.44,76.07 111.44,82.42 129.22,82.42 129.22,76.07 135.57,76.07 135.57,82.42 159.7,82.42 159.7,100.2
  pour Bottom: 152.84,82.93 152.84,73.02 159.95,73.02 159.95,83.18 152.84,83.18
0М
  pour Top: 152.84,82.67 152.84,73.02 159.95,73.02 159.95,83.18 152.84,83.18
!ADC_CS  (via drill 0.3 pad 0.8)
  Top 0.254: IC2.14 37.58,66.88 37.27,67.18 36.76,67.18 v36,67.94 | U2.6 82.23,40.76 82.48,40.51 v82.48,39.49
  Bottom 0.254: v36,67.94 36.76,67.18 70.8,67.18 74.36,63.62 74.36,61.84 73.59,61.08 73.59,58.29 74.36,57.53 80.96,57.53 82.74,55.75 82.74,40.76 82.48,40.51 v82.48,39.49
!ADC_DRDY  (via drill 0.3 pad 0.8, 0.3 pad 0.81)
  Top 0.254: U2.4 75.88,43.3 73.85,45.33 73.85,52.7 72.58,53.97 v69.53,53.97 | v48.45,66.16 47.69,66.92 43.62,66.92 arc90 43.58,66.88 IC2.2
  Bottom 0.254: v48.45,66.16 53.78,60.83 54.04,60.83 69.28,45.59 73.59,45.59 74.36,46.35 74.36,52.95 73.34,53.97 v69.53,53.97
!ADC_RST  (1 unrouted)
!ADC_SYNC  (1 unrouted)
!CS  (via drill 0.3 pad 0.8)
  Top 0.254: RN1.1 102.23,29.27 | v87.18,40.51 87.44,40.76 U2.11
  Top 0.305: 102.23,29.27 v102.17,29.33
  Bottom 0.254: v102.17,29.33 101.41,30.22 99.25,30.22 97.34,32.13 89.47,32.13 87.82,33.78 87.82,36.7 88.2,37.08 88.2,37.97 87.18,38.98 v87.18,40.51
!DRDY
  Top 0.254: RN1.2 101.43,33.89 92.01,43.3 U2.13
!MCLR
  Bottom 0.254: X1.P$1 JP1.P$1
!MCLR_
  Top 0.254: JP1.P$2 51.75,74.8 51.24,74.29 48.45,74.29 R8.P$2 44.64,70.23 44.64,69.21 44.38,68.96 41.59,68.96 41.08,68.44 IC2.7
!RST
  Top 0.254: D2.6 90.36,62.61 92.9,60.07 92.9,59.3 98.49,53.72 98.49,39.24 105.85,31.87 105.85,24.25 107.38,22.73 107.38,21.71 107.03,21.36 U3.15
  Bottom 0.254: D2.6 90.87,62.61 93.15,64.89 R103.P$2
!SYNC,PDWN
  Top 0.254: D2.7 90.61,65.15 92.9,62.86 | 92.9,62.61 93.66,61.84 R12.P$2 94.93,58.8 100.01,53.72 100.01,39.24 107.12,31.87 107.12,24.25 110.01,21.36 U3.14
  Top 0.305: 92.9,62.86 92.9,62.61
!XPORT_RST  (via drill 0.3 pad 0.8)
  Top 0.254: IC2.30 34.61,57.27 30.41,57.27 29.78,57.91 R7.P$2 v25.71,57.91
  Bottom 0.254: v25.71,57.91 24.83,57.02 20.51,57.02 17.46,53.97 17.46,20.95 12.85,16.34 XP1.3
+3.3V  (via drill 0.3 pad 0.8)
  Top 0.254: IC1.3 20,71.19 | 20,71.19 23.73,71.19 | IC2.26 31.48,59.26 30.41,60.32 28.13,60.32 R6.P$1 22.29,60.32 20,62.61 20,71.19 | C6.2 20.89,12.7 18.51,15.07 XP1.2 | C5.PLUS C6.2 | 39.08,59.05 39.08,59.3 37.02,59.3 v37.02,60.83 | v40.57,57.02 39.08,57.02 | IC2.10 39.58,71.5 38.92,71.5 38.8,71.24 38.41,71.24 C10.1 | C13.2 arc-90 45.78,35.94 | C13.2 arc-90 46.03,36.19 | 46.03,36.19 C15.2 arc-90 49.73,36.17 U1.1 | C6.2 24.45,26.66 27.11,29.33 43.62,29.33 44.64,30.35 44.64,32.65 U1.5 44.66,34.81 C13.2 | 41.91,60.26 41.84,60.32 v41.84,61.34 | 46.03,36.19 v43.37,36.19
  Top 0.305: 23.73,71.19 C2.1 | 39.56,65.69 IC2.10 39.58,63.64 39.08,63.14 39.08,59.28 | IC2.38 39.08,57.02 39.08,59.05 | IC2.26 38.87,59.26 arc-90 39.08,59.05 | 39.08,59.05 39.08,59.28 | 39.08,59.28 39.05,59.3 41.08,59.3 41.91,60.26 IC2.57 | R7.P$1 28,60.45 arc-90 28.13,60.32
  Bottom 0.254: v37.02,60.83 C100.1 | C103.1 40.95,56.64 v40.57,57.02 38.29,57.02 37.02,55.75 37.02,51.68 36.76,51.43 36.76,37.97 38.54,36.19 v43.37,36.19 | v41.84,61.34 42.48,61.97 C102.1
+3.3V_ADC
  Top 0.254: IC3.3 94.85,26.11 95.57,25.39 98.36,25.39 99.38,26.41 102.93,26.41 | 103.06,26.28 103.06,24.51 | 103.19,24.38 104.2,24.38 | U3.16 104.31,20.71 104.07,20.95 104.07,22.73 104.33,22.98 C28.2 | C24.1 93.41,19.3
  Top 0.305: 102.93,26.41 103.06,26.28 | 103.06,24.51 103.19,24.38 | 104.2,24.38 C28.2 | IC3.3 93.43,20.34 C22.2 93.41,19.3
+5V
  Top 0.254: C1.1 6.03,72.77 6.54,73.27 11.62,73.27 11.87,73.02 11.87,79.88 | 27.87,87.24 C4.1 16.44,87.24 12.13,82.93 12.13,80.13 | 37.78,78.1 36.51,79.37 34.22,79.37 27.87,85.72 27.87,87.24 | 27.87,90.13 27.87,87.24 | C7.1 31.43,8.5 32.95,6.98 C9.PLUS | X1.P$2 37.78,74.54 R8.P$1 | POT1.2 78.07,12.98 83.25,18.16 83.25,46.1 82.23,47.11 U2.1 78.93,47.11 78.04,48 C18.1 82.23,52.19 83.25,53.21 83.25,74.04 81.72,75.56 80.2,75.56 72.45,83.31 C17.1 67.75,87.75 66.36,86.35 OK1.8
  Top 0.305: IC1.1 11.87,71.29 11.87,73.02 | DA1.4 28,90.13 27.87,90.13 | 12.13,80.13 11.87,79.88 | X1.P$2 37.78,78.1
  Bottom 0.254: X1.P$2 37.78,78.48 D1.2 42.86,88.51 45.4,91.05 63.18,91.05 63.82,90.42 R100.P$1 OK1.7 63.82,82.29 64.2,81.91 65.97,81.91 66.36,82.29 OK1.8 | C9.PLUS 40.95,11.43 C104.2 51.75,9.27 53.4,7.62 DC1.1 58.73,10.79 | 58.73,10.79 58.73,13.71 59.37,14.35 R9.2 | POT1.2 78.07,11.45 77.4,10.79 58.73,10.79
+5V_ISO
  Top 0.254: 51.75,16.89 49.72,18.92 49.72,23.74 U1.16 55.3,23.75 arc-90 C16.1 | X3.P$1 51.75,13.33 51.5,13.33 47.94,9.77 C14.PLUS 49.97,6.98 52.26,4.69 70.8,4.69 71.44,5.33 DC1.6
  Top 0.305: 51.75,16.89 X3.P$1
+6V
  Top 0.254: DA1.5 DA1.1
  Top 0.305: C8.1 34.1,95.24 33.97,95.37
  Top 0.406: 100.29,90.29 114.49,90.29 119.57,95.37 125.41,95.37 127.7,93.09 D3.C 138.11,93.09 139.13,92.07 F1.2 | 100.29,90.29 DA2.1 DA2.5 | 100.29,90.29 100.29,92.93 C26.1 99.76,92.96 98.49,94.23 94.55,94.23 91.63,97.15 44.13,97.15 42.35,95.37 33.97,95.37 31.18,95.37 31.02,95.22 DA1.1
+15V
  Top 0.254: DC3.6 143.44,76.58 145.48,74.54 145.48,72.38 C58.2 144.46,72 142.94,70.48 123.12,70.48 120.97,68.32 C34.PLUS 115.12,65.4 IC4.7
+IN1
  Top 0.254: R28.P$1 141.92,9.52 140.65,8.25 C57.1 138.11,8.25 136.84,6.98 C46.1 129.86,6.98 129.47,7.36 C40.1 123.25,7.36 114.45,16.16 U3.6
+IN1+
  Top 0.254: X5.8 150.81,10.79 149.54,9.52 R28.P$2
+IN2
  Top 0.254: R26.P$1 141.92,17.14 141.28,17.77 C55.1 C44.1 | C45.2 C44.1 | C39.2 C38.1 129.86,17.52 130.11,17.77 C44.1 | U3.8 125.99,17.46
  Top 0.406: 125.99,17.46 C38.1
+IN2+
  Top 0.254: R26.P$2 147.33,18.1 X5.6
+IN3
  Top 0.254: R24.P$1 141.92,24.76 141.28,25.39 C53.1 C43.2 | C36.1 129.98,27.68 | 130.24,27.93 C42.1 | U3.10 114.34,18.76 120.71,25.14
  Top 0.305: C43.2 C42.1 | 129.98,27.68 130.24,27.93 | 120.71,25.14 C37.2
  Top 0.406: C37.2 C36.1
+IN3+
  Top 0.254: X5.4 149.06,23.59 147.89,24.76 R24.P$2
+IN4
  Top 0.254: 140.9,34.67 143.19,32.38 | C51.1 137.35,34.67 136.33,33.65 C41.1 130.49,33.65 130.11,34.03 126.55,34.03 | U3.12 113.22,20.06 121.85,28.7 121.85,31.36 124.52,34.03 C35.1
  Top 0.305: C51.1 140.9,34.67
  Top 0.406: 143.19,32.38 R22.P$1 | C35.1 126.55,34.03
+IN4+
  Top 0.254: R22.P$2 147.76,32.38 149.16,30.98 | 149.16,29.71 149.67,29.2 150.68,29.2 X5.2
  Top 0.305: 149.16,30.98 149.16,29.71
-15V
  Top 0.254: DC3.4 138.36,72.13 C50.2
  Bottom 0.254: C27.MINUS 99.63,71.11 101.15,69.59 101.15,61.08 101.92,60.32 IC4.4 106.87,60.32 108.39,61.84 108.39,67.18 115.5,74.29 135.57,74.29 138.36,77.08 DC3.4
-IN1
  Top 0.254: R27.P$1 141.92,13.33 141.28,12.7 C56.1 C45.1 | C46.2 C45.1 | 129.86,12.7 C45.1 | C40.2 C39.1 119.31,12.44 114.94,16.81 U3.7
  Top 0.305: C39.1 129.6,12.44 129.86,12.7
-IN1-
  Top 0.254: R27.P$2 148.4,15.36 X5.7
-IN2
  Top 0.254: R25.P$1 141.92,20.95 141.67,20.7 C54.1 136.71,20.7 136.33,20.31 C44.2 C43.1 130.11,22.85 129.86,22.6 C37.1 C38.2 116.77,20.06 114.83,18.11 U3.9
-IN2-
  Top 0.254: R25.P$2 150.71,20.95 X5.5
-IN3
  Top 0.254: R23.P$1 140.9,28.57 C52.1 136.84,30.09 136.46,30.47 C42.2 130.36,30.47 130.11,30.22 C36.2 124.52,30.22 113.72,19.41 U3.11
-IN3-
  Top 0.254: R23.P$2 147.64,28.57 148.02,28.19 148.02,27.3 148.91,26.41 arc90 148.98,26.33 X5.3
-IN4
  Top 0.254: R21.P$1 141.16,36.19 140.9,35.94 135.19,35.94 134.94,36.19 C41.2 130.62,36.19 130.24,36.57 C35.2 124.78,36.57 124.27,36.06 124.27,34.92 121.09,31.74 121.09,29.08 112.73,20.71 U3.13
  Top 0.305: R21.P$1 C61.1 | C35.2 R18.P$2
-IN4-
  Top 0.254: X5.1 148.91,33.73 148.91,34.92 147.64,36.19 R21.P$2
ADC_AVDD  (via drill 0.3 pad 0.8, 0.3 pad 0.81)  (1 unrouted)
  Top 0.254: DA2.4 97.24,84.68 v97.72,84.2 | 87.56,20.7 86.8,19.93 v86.8,19.17 | 97.23,86.35 95.57,86.35 95.18,85.97 93.41,85.97 89.09,85.97 87.31,87.75 C20.PLUS | DC2.1 106.23,83.81 106.36,83.94 C29.2 115.38,86.1 115.76,85.72 118.55,85.72 C32.PLUS 124.78,85.85 C107.1 127.95,85.97 128.97,84.96 C108.1 130.87,81.78 130.74,81.66 DC3.1 | v112.71,11.04 112.33,10.66
  Top 0.305: C19.2 88.71,20.7 87.56,20.7 | 97.23,86.35 DA2.4
  Top 0.406: 88.81,20.85 C19.2
  Bottom 0.254: v86.8,19.17 86.8,10.79 89.85,7.74 109.41,7.74 v112.71,11.04 | DC2.1 97.72,79.24 97.6,79.37 97.6,82.55 97.72,82.67
  Bottom 0.305: 97.72,82.67 v97.72,84.2
ADC_DIN  (via drill 0.3 pad 0.8)
  Top 0.254: IC2.6 41.58,67.92 42.1,68.45 51.5,68.45 52.26,67.69 v52.26,66.16 | v81.98,42.03 U2.5
  Bottom 0.254: 73.09,45.33 76.39,42.03 v81.98,42.03 81.98,54.73 80.45,56.26 74.1,56.26 72.58,57.78 72.58,62.86 69.28,66.16 v52.26,66.16
ADC_DOUT  (via drill 0.3 pad 0.8, 0.3 pad 0.81)
  Top 0.254: IC2.5 42.08,67.41 42.61,67.94 50.48,67.94 51.24,67.18 51.24,65.91 v52.26,64.89 | v72.07,50.41 72.07,43.56 76.13,39.49 U2.7
  Bottom 0.254: v72.07,50.41 66.74,50.41 v52.26,64.89
ADC_OSC1
  Top 0.254: 106.51,18.76 106.87,18.41 106.87,12.31 101.03,6.47 100.01,6.47 99.25,7.23 X4.1
  Top 0.305: U3.19 106.51,18.76
  Bottom 0.254: C105.1 97.6,10.41 97.72,10.28 X4.1
ADC_OSC2
  Top 0.254: 101.03,5.46 107.38,11.81 107.38,18.66 106.62,19.41 U3.18
  Top 0.305: X4.2 101.03,5.46
  Bottom 0.254: X4.2 94.68,5.46
  Bottom 0.305: 94.68,5.46 C106.1
ADC_SCLK  (via drill 0.3 pad 0.8, 0.3 pad 0.81)
  Top 0.254: 42.58,66.89 IC2.4 42.58,67.15 42.86,67.43 49.97,67.43 50.23,67.18 v50.23,66.16 | v70.55,52.45 72.58,52.45 73.09,51.94 73.09,45.33 75.75,42.67 81.6,42.67 81.98,43.05 81.98,44.32 81.72,44.57 U2.3
  Bottom 0.254: v50.23,66.16 50.23,65.4 69.53,46.1 73.09,46.1 73.85,46.86 73.85,51.94 73.34,52.45 v70.55,52.45
AVDD
  Top 0.254: IC2.19 23.91,62.76
  Top 0.305: 23.91,62.76 R6.P$2
D_VDD(+5V)  (8 unrouted)
  Top 0.254: IC5.7 C47.1 140.14,65.4 143.19,62.35 C59.1 143.19,53.82
  Top 0.406: 143.19,53.82 IC6.1
DGND  (via drill 0.3 pad 0.8)
  Top 0.254: U3.2 109.68,13.56 | 111.15,13.58 109.15,13.58
  Top 0.305: U3.17 108.01,20.06 108.65,19.43 108.65,16.89 109.79,15.74 | 109.79,15.74 110.02,15.52 U3.5 | U3.2 111.15,13.58 | 109.15,13.58 109.79,14.22 109.79,15.74
  Top 0.406: 109.68,13.56 109.66,13.58
  other vias: 88.33,2.66 102.55,13.58 95.44,20.7 91.12,22.73 87.06,23.49 89.6,13.84 109.41,3.42 119.06,2.41 127.95,4.19 129.98,10.03 129.98,15.11 129.73,20.7 121.6,22.22 129.73,25.01 128.97,32.38 116.77,28.06 110.17,33.14 117.54,35.94 127.7,50.16 118.04,50.67 109.41,50.67 94.42,50.41 95.69,44.83 92.14,38.22 96.45,34.16 103.82,31.11 108.14,42.29 135.57,41.78 142.17,30.86 147.76,34.16 136.33,22.98 136.33,27.81 136.08,32.13 136.33,37.71 127.7,44.06 121.6,15.11 121.6,18.66 121.6,11.04 135.82,4.19 144.46,1.14 154.87,11.04 157.92,11.55 148.78,12.57 148.78,16.89 148.78,19.68 148.78,22.47 149.03,25.27 149.29,28.06 154.62,34.41 158.43,37.71 158.18,46.86 150.3,49.14 144.71,49.14 138.11,60.57 150.3,60.57 150.3,66.67 128.71,67.43 128.71,62.86 135.06,49.4 103.57,57.27 117.79,57.78 117.54,64.38 109.66,66.67 88.83,73.02 92.9,77.59 116.27,76.32 111.69,73.27 124.14,72.51 125.16,76.83 132.01,72.26 135.57,72.26 135.32,67.43 149.79,75.05 157.92,66.67
  pour Top: 86.04,81.15 86.04,-0.13 159.7,-0.13 159.7,70.99 159.7,71.6 151.42,71.6 151.42,76.14 151.42,81.15 136.84,81.15 136.84,74.8 127.95,74.8 127.95,81.15 112.71,81.15 112.71,74.8 102.55,74.8 102.55,81.15
  pour Bottom: 86.04,81.15 86.04,-0.13 87.31,-0.13 159.7,-0.13 159.7,71.6 151.39,71.6 151.39,81.15 136.84,81.15 136.84,74.8 127.95,74.8 127.95,81.15 112.71,81.15 112.71,74.8 102.55,74.8 102.55,81.15
DIN
  Top 0.254: RN1.4 99.83,33.83 91.63,42.03 U2.12
DOUT  (via drill 0.3 pad 0.8)
  Top 0.254: RN1.3 100.63,29.31 | v87.18,37.71 87.18,39.11 87.56,39.49 U2.10
  Top 0.305: RN1.3 100.65,27.3 | 100.63,29.31 v100.65,29.33
  Bottom 0.254: v100.65,29.33 99.25,29.33 97.09,31.49 89.09,31.49 87.06,33.52 87.06,37.59 v87.18,37.71
EXT_START  (via drill 0.3 pad 0.8)
  Top 0.254: IC2.11 39.08,69.26 v38.67,69.67
  Bottom 0.254: R100.P$2 OK1.6 61.27,82.04 60.89,81.66 43.11,81.66 39.05,77.59 39.05,74.8 38.67,74.29 v38.67,69.67
I_SENS
  Bottom 0.254: X5.9 153.35,32 139,46.35 R20.2 R19.2 128.46,57.91 128.46,59.81 125.41,62.86 IC5.3
ISO_GND
  Top 0.254: 48.45,23.74 48.45,18.66 49.21,17.9 | C14.MINUS 46.42,4.44 45.65,5.2 45.65,9.77 49.21,13.33 X3.P$2 | C16.2 48.45,26.03 | 48.45,26.03 arc-90 48.46,26.01 U1.15 | U1.9 40.84,25.29 41.59,26.03 42.12,26.03 | 42.12,26.03 48.45,26.03 | U1.10 42.12,26.03
  Top 0.305: U1.15 48.45,23.74 | 49.21,17.9 X3.P$2
  Bottom 0.254: DC1.4 66.36,5.08 65.72,4.44 C14.MINUS
LCD_DB4  (via drill 0.3 pad 0.8)
  Top 0.254: IC2.61 47.78,62.26 47.94,62.1 47.94,58.54 v51.5,54.99
  Bottom 0.254: SV1.7 70.8,36.19 53.02,53.97 52.51,53.97 v51.5,54.99
LCD_DB5  (via drill 0.3 pad 0.8)
  Top 0.254: IC2.60 47.27,61.76 47.43,61.59 47.43,57.27 v51.5,53.21
  Bottom 0.254: SV1.8 69.53,29.84 69.53,36.19 53.53,52.19 52.51,52.19 v51.5,53.21
LCD_DB6  (via drill 0.3 pad 0.8)
  Top 0.254: IC2.37 38.58,52.41 38.8,52.19 v38.8,50.92
  Bottom 0.254: v38.8,50.92 38.8,50.16 45.4,43.56 56.32,43.56 67.24,32.63 68.01,32.63 68.26,32.38 SV1.9
LCD_DB7  (via drill 0.3 pad 0.8)
  Top 0.254: IC2.36 38.08,52.49 37.78,52.19 v37.78,51.68
  Bottom 0.254: SV1.10 66.99,29.84 66.99,31.87 56.07,42.79 45.4,42.79 37.78,50.41 v37.78,51.68
LCD_E  (via drill 0.3 pad 0.8)
  Top 0.254: IC2.62 48.05,62.76 48.45,62.35 48.45,59.81 v51.5,56.76
  Bottom 0.254: SV1.6 72.07,29.84 72.07,36.19 v51.5,56.76
LCD_RS  (via drill 0.3 pad 0.8)
  Top 0.254: IC2.64 48.57,63.76 49.46,62.86 49.46,62.1 v51.5,60.07
  Bottom 0.254: SV1.4 77.15,29.84 77.15,32.13 77.4,32.38 77.4,35.68 54.04,59.05 52.51,59.05 v51.5,60.07
LCD_RW  (via drill 0.3 pad 0.8)
  Top 0.254: IC2.63 48.31,63.26 48.96,62.61 48.96,61.08 v51.5,58.54
  Bottom 0.254: SV1.5 73.34,36.19 54.04,55.49 54.04,56 v51.5,58.54
MCU_PORT  (via drill 0.3 pad 0.8)
  Top 0.254: IC2.3 43.08,64.42 43.11,64.38 48.96,64.38 v51.5,61.84 | R10.P$1 78.29,26.92 78.42,27.05 SV1.2
  Bottom 0.254: SV1.2 79.69,28.57 80.45,29.33 80.45,33.65 54.04,60.07 53.27,60.07 v51.5,61.84
N$1  (via drill 0.3 pad 0.8)
  Top 0.254: IC2.56 43.82,59.76 v43.37,59.3
  Bottom 0.254: v43.37,59.3 C101.1
N$2
  Top 0.254: JP1.P$3 54.29,78.1 47.3,85.08 D1.1
N$3
  Top 0.254: U3.20 103.73,18.11 102.3,19.55 102.3,25.44
  Top 0.406: 102.3,25.44 RN1.8
N$4
  Top 0.254: 101.41,19.17 101.41,25.49
  Top 0.305: U3.21 103.11,17.46 101.41,19.17
  Top 0.406: 101.41,25.49 RN1.7
N$5
  Top 0.254: 100.65,18.92 100.65,25.49
  Top 0.305: U3.22 102.75,16.81 100.65,18.92
  Top 0.406: 100.65,25.49 RN1.6
N$6
  Top 0.254: RN1.5 99.83,18.72
  Top 0.305: 99.83,18.72 102.42,16.12 105.41,16.12 | 105.98,16.12 105.41,16.12 | 105.41,16.12 U3.23
N$7
  Top 0.305: U3.24 101.89,15.52 97.09,20.31 R13.P$2
N$10
  Bottom 0.254: D2.1 77.91,67.69 R101.P$1
N$12
  Bottom 0.254: IC4.5 116.01,60.32 121.09,65.4 IC5.2 129.86,65.4 IC5.6
N$14
  Top 0.254: DA2.3 97.24,92.93
  Top 0.406: 97.24,92.93 C25.2
N$15
  Bottom 0.254: D2.4 R102.P$1
N$16
  Top 0.254: DA1.3 28.03,94.97 27.62,95.37 24.57,95.37 24.32,95.12 24.32,93.72
  Top 0.305: 24.32,93.72 C3.2
N$17
  Bottom 0.254: R14.2 110.68,53.34 109.15,54.86 109.15,61.97 110.04,62.86 IC4.6
N$18
  Top 0.254: POT1.3 76.8,21.03 77.02,21.25 77.02,28.19 77.15,28.32 77.15,29.84 SV1.3
N$19
  Top 0.254: R9.1 69.4,16.5 66.99,18.92 66.99,29.84 SV1.11
N$20  (via drill 0.3 pad 0.8)
  Top 0.254: IC2.28 34.59,58.29 32.7,58.29 32.45,58.03 v32.19,58.03 | v20.51,55.75 20.38,55.88 R5.P$1
  Bottom 0.254: v32.19,58.03 30.41,58.03 28.13,55.75 v20.51,55.75
N$21
  Top 0.254: HL2.A 8.06,55.24 8.7,55.88 R5.P$2
N$24
  Bottom 0.254: JP2.1 8.06,83.69 8.57,84.2 8.57,91.05 10.35,92.83 53.78,92.83 56.58,95.63 60.89,95.63 61.27,95.24 OK1.3
N$26
  Top 0.254: R1.P$2 HL3.A
N$28
  Top 0.254: XP1.6 9.37,20.73 10.6,21.97 10.6,28.57 14.67,32.63 14.67,37.46 13.65,38.48 11.36,38.48 10.7,39.14 10.7,42.95 12,44.24 R1.P$1
N$29
  Top 0.254: XP1.7 11.9,28.73 15.55,32.38 15.55,37.71 14.41,39.09 13.27,40.51 12.25,40.51 R2.P$1
N$30
  Top 0.254: R3.P$1 12.13,35.43 12.13,31.36 9.37,28.6 XP1.8
N$31
  Top 0.254: R2.P$2 HL4.A
N$32
  Top 0.254: R3.P$2 HL5.A
N$38
  Bottom 0.254: OK1.2 63.82,96.01 63.43,96.39 55.56,96.39 54.8,95.63 53.27,95.63 R104.P$2
N$39
  Bottom 0.254: JP2.2 6.03,91.05 10.35,95.37 50.48,95.37 R104.P$1
N$42
  Top 0.406: F1.1 SV2.1
  Bottom 0.406: SV2.1 SV2.2 SV2.4 | SV2.5 SV2.3 SV2.4 | SV2.6 SV2.4
N$43
  Top 0.254: R4.P$1 19.36,60.96 21.52,58.8 26.1,58.8 26.35,59.05 30.77,59.05 31.07,58.75 31.08,58.76 IC2.27
N$44
  Bottom 0.254: R15.1 R14.1
N$45  (via drill 0.3 pad 0.8)
  Top 0.254: U3.3 112.96,14.21 v112.96,14.09
  Bottom 0.254: v112.96,14.09 114.49,14.09 R16.P$1
N$46
  Bottom 0.254: R19.1 R20.1 R15.2
N$47
  Top 0.254: X3.P$3 46.67,17.9 47.2,18.43 U1.14
N$48
  Top 0.254: HL1.A 8.06,60.32 8.7,60.96 R4.P$2
N$51
  Top 0.254: X3.P$4 45.92,18.3 U1.13
N$52
  Top 0.254: X3.P$5 44.66,19.57 U1.12
N$53
  Top 0.254: X3.P$6 43.38,20.84 U1.11
OSC1
  Top 0.254: IC2.39 39.58,49.29 X2.1 39.3,46.98 C11.1
OSC2
  Top 0.254: C12.1 42.35,47.24 X2.2 43.11,49.14 42.86,49.4 40.57,49.4 40.07,49.91 40.07,54.3 IC2.40
PGC
  Top 0.254: 30.16,66.67 X1.P$5
  Top 0.305: IC2.17 33.08,63.76 30.16,66.67
PGD
  Top 0.254: 29.14,75.31 28.64,75.81 28.64,76.83 29.4,77.59 31.3,77.59 X1.P$4
  Top 0.305: IC2.18 32.56,63.26 29.14,66.67 29.14,75.31
REF_ISRC
  Top 0.254: IC6.2 141.99,51.75 141.67,51.43 C48.1 | 120.52,6.41 124.78,2.03 153.73,2.03 156.65,4.95 156.65,41.4 152.33,45.72 C60.1 C49.1 C48.1 | C33.1 119.31,5.46 119.57,5.46 120.52,6.41 | 120.52,6.41 121.35,7.23 121.35,7.49 120.72,8.11 | IC4.3 106.61,62.86 106.87,63.11 | 106.87,63.11 106.87,63.37 C31.1 | C48.1 140.02,53.59 138.11,55.49 108.65,55.49 106.87,57.27 106.87,63.11
  Top 0.305: 120.72,8.11 R17.P$1
  Top 0.406: 120.47,8.11 R17.P$1
SCLK  (via drill 0.3 pad 0.8)
  Top 0.254: v87.18,42.29 87.18,44.19 87.56,44.57 U2.14
  Top 0.305: v97.09,29.33 R13.P$1
  Bottom 0.254: v87.18,42.29 86.29,41.52 86.29,33.4 88.83,30.86 95.57,30.86 v97.09,29.33
SDO2,U1TX  (via drill 0.3 pad 0.8)
  Top 0.254: U1.6 43.37,32.66 43.37,33.9 v42.48,34.79 | IC2.33 36.58,52.26 v36,51.68
  Bottom 0.254: v36,51.68 36,37.97 38.54,35.43 41.84,35.43 v42.48,34.79
VREF+
  Top 0.254: 111.15,14.85 114.49,14.85 114.74,14.6 C62.2 116.01,13.33 116.77,12.57 116.77,11.81 118.18,10.4 118.18,10.16 118.54,10.16
  Top 0.305: 111.15,14.85 U3.4
  Top 0.406: R17.P$2 118.54,10.16
XPORT_RX
  Top 0.254: XP1.5 11.94,18.92 12.89,18.92 14.16,20.19 14.16,22.73 13.4,23.49 13.4,27.81 21.52,35.94 21.52,54.73 23.05,56.26 35.24,56.26 IC2.32
XPORT_TX
  Top 0.254: IC2.31 22.79,56.76 21.02,54.99 21.02,36.19 12.89,28.06 12.89,23.24 13.65,22.47 13.65,20.7 13.14,20.19 11.36,20.19 9.84,18.66 9.59,18.66 9.37,18.44 XP1.4
(copper drawn outside any net)
  shapes: Bottom area x2

### Text on the board
Top: KRION6 TERMOCONTROL LHEP JINR